# EAGLE design randomcontroller (EAGLE 6.1)
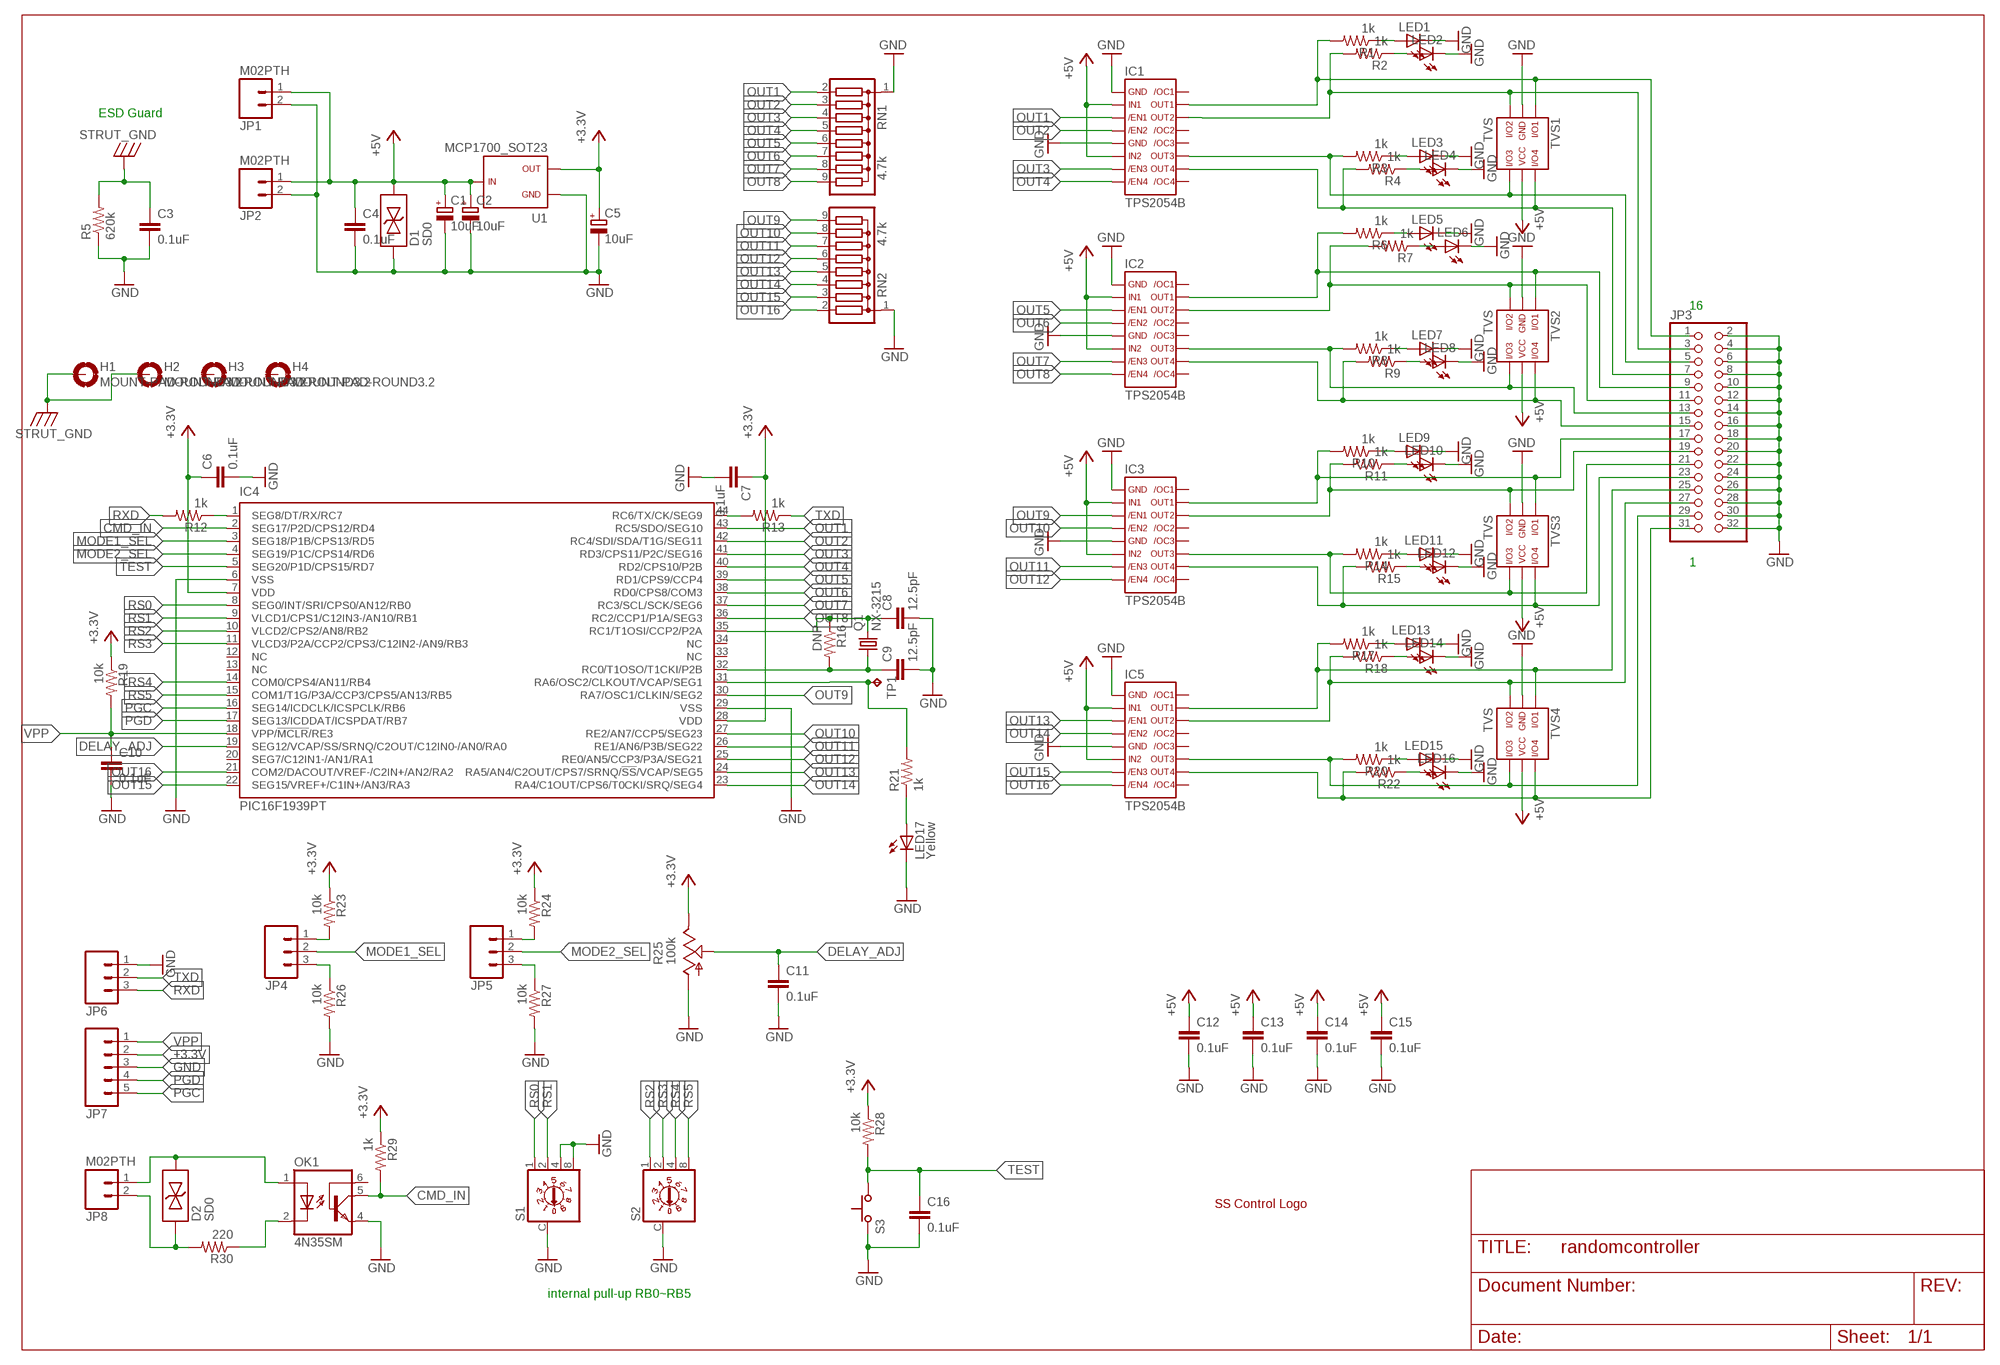
[diagram p0: schematic, sheet 1]

## Parts
C1  10uF  C-TANTAL-A  [C1206(3216)-A]
C2  10uF  C-TANTAL-A  [C1206(3216)-A]
C3  0.1uF  C0805(2012)  [C0805(2012)]
C4  0.1uF  C0805(2012)  [C0805(2012)]
C5  10uF  C-TANTAL-A  [C1206(3216)-A]
C6  0.1uF  C0805(2012)  [C0805(2012)]
C7  0.1uF  C0805(2012)  [C0805(2012)]
C8  12.5pF  C0805(2012)  [C0805(2012)]
C9  12.5pF  C0805(2012)  [C0805(2012)]
C10  0.1uF  C0805(2012)  [C0805(2012)]
C11  0.1uF  C0805(2012)  [C0805(2012)]
C12  0.1uF  C0805(2012)  [C0805(2012)]
C13  0.1uF  C0805(2012)  [C0805(2012)]
C14  0.1uF  C0805(2012)  [C0805(2012)]
C15  0.1uF  C0805(2012)  [C0805(2012)]
C16  0.1uF  C0805(2012)  [C0805(2012)]
D1  SD0  [SOD-323]
D2  SD0  [SOD-323]
H1  MOUNT-PAD-ROUND3.2  [3,2-PAD]
H2  MOUNT-PAD-ROUND3.2  [3,2-PAD]
H3  MOUNT-PAD-ROUND3.2  [3,2-PAD]
H4  MOUNT-PAD-ROUND3.2  [3,2-PAD]
IC1  TPS2054B  [R-PDSO-G16]
IC2  TPS2054B  [R-PDSO-G16]
IC3  TPS2054B  [R-PDSO-G16]
IC4  PIC16F1939PT  [TQFP44]
IC5  TPS2054B  [R-PDSO-G16]
JP1  M02PTH  [1X02]
JP2  M02PTH  [1X02]
JP3  PINHD-2X16/90  [2X16/90]
JP4  M03PTH  [1X03]
JP5  M03PTH  [1X03]
JP6  M03PTH  [1X03]
JP7  M05PTH  [1X05]
JP8  M02PTH  [1X02]
LED1  LEDCHIPLED_0805  [CHIPLED_0805]
LED2  LEDCHIPLED_0805  [CHIPLED_0805]
LED3  LEDCHIPLED_0805  [CHIPLED_0805]
LED4  LEDCHIPLED_0805  [CHIPLED_0805]
LED5  LEDCHIPLED_0805  [CHIPLED_0805]
LED6  LEDCHIPLED_0805  [CHIPLED_0805]
LED7  LEDCHIPLED_0805  [CHIPLED_0805]
LED8  LEDCHIPLED_0805  [CHIPLED_0805]
LED9  LEDCHIPLED_0805  [CHIPLED_0805]
LED10  LEDCHIPLED_0805  [CHIPLED_0805]
LED11  LEDCHIPLED_0805  [CHIPLED_0805]
LED12  LEDCHIPLED_0805  [CHIPLED_0805]
LED13  LEDCHIPLED_0805  [CHIPLED_0805]
LED14  LEDCHIPLED_0805  [CHIPLED_0805]
LED15  LEDCHIPLED_0805  [CHIPLED_0805]
LED16  LEDCHIPLED_0805  [CHIPLED_0805]
LED17  Yellow  LEDCHIPLED_0805  [CHIPLED_0805]
OK1  4N35SM  [DIL6-SMD]
Q1  NX-3215  [NX-3215]
R1  1k  R0805(2012)  [R0805(2012)]
R2  1k  R0805(2012)  [R0805(2012)]
R3  1k  R0805(2012)  [R0805(2012)]
R4  1k  R0805(2012)  [R0805(2012)]
R5  620k  R0805(2012)  [R0805(2012)]
R6  1k  R0805(2012)  [R0805(2012)]
R7  1k  R0805(2012)  [R0805(2012)]
R8  1k  R0805(2012)  [R0805(2012)]
R9  1k  R0805(2012)  [R0805(2012)]
R10  1k  R0805(2012)  [R0805(2012)]
R11  1k  R0805(2012)  [R0805(2012)]
R12  1k  R0805(2012)  [R0805(2012)]
R13  1k  R0805(2012)  [R0805(2012)]
R14  1k  R0805(2012)  [R0805(2012)]
R15  1k  R0805(2012)  [R0805(2012)]
R16  DNP  R0805(2012)  [R0805(2012)]
R17  1k  R0805(2012)  [R0805(2012)]
R18  1k  R0805(2012)  [R0805(2012)]
R19  10k  R0805(2012)  [R0805(2012)]
R20  1k  R0805(2012)  [R0805(2012)]
R21  1k  R0805(2012)  [R0805(2012)]
R22  1k  R0805(2012)  [R0805(2012)]
R23  10k  R0805(2012)  [R0805(2012)]
R24  10k  R0805(2012)  [R0805(2012)]
R25  100k  TRIM_US-B25P  [B25P]
R26  10k  R0805(2012)  [R0805(2012)]
R27  10k  R0805(2012)  [R0805(2012)]
R28  10k  R0805(2012)  [R0805(2012)]
R29  1k  R0805(2012)  [R0805(2012)]
R30  220  R0805(2012)  [R0805(2012)]
RN1  4.7k  G08R  [SIL9]
RN2  4.7k  G08R  [SIL9]
S1  S20BCD  [S20BCD]
S2  S20BCD  [S20BCD]
S3  SWITCH  [SKHLACA010]
TP1  TP  [TP-13]
TVS1  TVS  [TSOP-6]
TVS2  TVS  [TSOP-6]
TVS3  TVS  [TSOP-6]
TVS4  TVS  [TSOP-6]
U1  MCP1700_SOT23  [SOT23]
U$1  LOGO  [SSCONTROL]

## Nets
+3.3V: C5.1(+) C6.1 C7.1 IC4.7(VDD) IC4.28(VDD) JP7.2 R19.1 R23.1 R24.1 R25.E R28.1 R29.1 U1.2
+5V: C1.1(+) C2.1(+) C4.1 C12.1 C13.1 C14.1 C15.1 D1.2 IC1.2 IC1.6 IC2.2 IC2.6 IC3.2 IC3.6 IC5.2 IC5.6 JP1.1 JP2.1 TVS1.5 TVS2.5 TVS3.5 TVS4.5 U1.3
CLKOUT: IC4.31(RA6/OSC2/CLKOUT/VCAP/SEG1) R21.2 TP1.TP
CMD_IN: IC4.2(SEG17/P2D/CPS12/RD4) OK1.5(COL) R29.2
DELAY_ADJ: C11.1 IC4.19(SEG12/VCAP/SS/SRNQ/C2OUT/C12IN0-/AN0/RA0) R25.S
GND: C1.2(-) C2.2(-) C3.2 C4.2 C5.2(-) C6.2 C7.2 C8.2 C9.2 C10.2 C11.2 C12.2 C13.2 C14.2 C15.2 C16.2 D1.1 IC1.1 IC1.5 IC2.1 IC2.5 IC3.1 IC3.5 IC4.6(VSS) IC4.29(VSS) IC5.1 IC5.5 JP1.2 JP2.2 JP3.2 JP3.4 JP3.6 JP3.8 JP3.10 JP3.12 JP3.14 JP3.16 JP3.18 JP3.20 JP3.22 JP3.24 JP3.26 JP3.28 JP3.30 JP3.32 JP6.1 JP7.3 LED1.C LED2.C LED3.C LED4.C LED5.C LED6.C LED7.C LED8.C LED9.C LED10.C LED11.C LED12.C LED13.C LED14.C LED15.C LED16.C LED17.C OK1.4(EMI) R5.1 R25.A R26.2 R27.2 RN1.1 RN2.1 S1.4 S1.8 S1.C S2.C S3.P$1 TVS1.2 TVS2.2 TVS3.2 TVS4.2 U1.1
MODE1_SEL: IC4.3(SEG18/P1B/CPS13/RD5) JP4.2
MODE2_SEL: IC4.4(SEG19/P1C/CPS14/RD6) JP5.2
N$1: D2.2 JP8.1 OK1.1(A)
N$2: LED1.A R1.1
N$3: OK1.2(C) R30.1
N$4: D2.1 JP8.2 R30.2
N$5: LED2.A R2.1
N$6: C8.1 IC4.35(RC1/T1OSI/CCP2/P2A) Q1.2 R16.1
N$7: C9.1 IC4.32(RC0/T1OSO/T1CKI/P2B) Q1.1 R16.2
N$8: LED3.A R3.1
N$9: LED4.A R4.1
N$10: LED5.A R6.1
N$11: LED6.A R7.1
N$12: IC1.15 JP3.1 R1.2 TVS1.1
N$13: IC1.14 JP3.3 R2.2 TVS1.3
N$14: IC1.11 JP3.5 R3.2 TVS1.4
N$15: IC1.10 JP3.7 R4.2 TVS1.6
N$16: IC2.15 JP3.9 R6.2 TVS2.1
N$17: IC2.14 JP3.11 R7.2 TVS2.3
N$18: IC2.11 JP3.13 R8.2 TVS2.4
N$19: IC2.10 JP3.15 R9.2 TVS2.6
N$20: IC3.14 JP3.19 R11.2 TVS3.3
N$21: IC3.11 JP3.21 R14.2 TVS3.4
N$22: IC3.10 JP3.23 R15.2 TVS3.6
N$23: IC3.15 JP3.17 R10.2 TVS3.1
N$24: IC5.14 JP3.27 R18.2 TVS4.3
N$25: IC5.15 JP3.25 R17.2 TVS4.1
N$26: IC5.11 JP3.29 R20.2 TVS4.4
N$27: IC5.10 JP3.31 R22.2 TVS4.6
N$28: LED9.A R10.1
N$29: LED10.A R11.1
N$30: LED11.A R14.1
N$31: LED12.A R15.1
N$32: LED17.A R21.1
N$48: LED13.A R17.1
N$49: LED14.A R18.1
N$50: LED15.A R20.1
N$51: LED16.A R22.1
N$52: LED7.A R8.1
N$53: LED8.A R9.1
N$54: IC4.1(SEG8/DT/RX/RC7) R12.1
N$55: IC4.44(RC6/TX/CK/SEG9) R13.2
N$56: JP5.1 R24.2
N$57: JP4.1 R23.2
N$58: JP4.3 R26.1
N$59: JP5.3 R27.1
OUT1: IC1.3 IC4.43(RC5/SDO/SEG10) RN1.2
OUT2: IC1.4 IC4.42(RC4/SDI/SDA/T1G/SEG11) RN1.3
OUT3: IC1.7 IC4.41(RD3/CPS11/P2C/SEG16) RN1.4
OUT4: IC1.8 IC4.40(RD2/CPS10/P2B) RN1.5
OUT5: IC2.3 IC4.39(RD1/CPS9/CCP4) RN1.6
OUT6: IC2.4 IC4.38(RD0/CPS8/COM3) RN1.7
OUT7: IC2.7 IC4.37(RC3/SCL/SCK/SEG6) RN1.8
OUT8: IC2.8 IC4.36(RC2/CCP1/P1A/SEG3) RN1.9
OUT9: IC3.3 IC4.30(RA7/OSC1/CLKIN/SEG2) RN2.9
OUT10: IC3.4 IC4.27(RE2/AN7/CCP5/SEG23) RN2.8
OUT11: IC3.7 IC4.26(RE1/AN6/P3B/SEG22) RN2.7
OUT12: IC3.8 IC4.25(RE0/AN5/CCP3/P3A/SEG21) RN2.6
OUT13: IC4.24(RA5/AN4/C2OUT/CPS7/SRNQ/!SS!/VCAP/SEG5) IC5.3 RN2.5
OUT14: IC4.23(RA4/C1OUT/CPS6/T0CKI/SRQ/SEG4) IC5.4 RN2.4
OUT15: IC4.22(SEG15/VREF+/C1IN+/AN3/RA3) IC5.7 RN2.3
OUT16: IC4.21(COM2/DACOUT/VREF-/C2IN+/AN2/RA2) IC5.8 RN2.2
PGC: IC4.16(SEG14/ICDCLK/ICSPCLK/RB6) JP7.5
PGD: IC4.17(SEG13/ICDDAT/ICSPDAT/RB7) JP7.4
RS0: IC4.8(SEG0/INT/SRI/CPS0/AN12/RB0) S1.1
RS1: IC4.9(VLCD1/CPS1/C12IN3-/AN10/RB1) S1.2
RS2: IC4.10(VLCD2/CPS2/AN8/RB2) S2.1
RS3: IC4.11(VLCD3/P2A/CCP2/CPS3/C12IN2-/AN9/RB3) S2.2
RS4: IC4.14(COM0/CPS4/AN11/RB4) S2.4
RS5: IC4.15(COM1/T1G/P3A/CCP3/CPS5/AN13/RB5) S2.8
RXD: JP6.3 R12.2
STRUT_GND: C3.1 H1.B3,2(MOUNT) H2.B3,2(MOUNT) R5.2
TEST: C16.1 IC4.5(SEG20/P1D/CPS15/RD7) R28.2 S3.P$2
TXD: JP6.2 R13.1
VPP: C10.1 IC4.18(VPP/!MCLR!/RE3) JP7.1 R19.2
Unconnected: H3.B3,2(MOUNT) H4.B3,2(MOUNT) IC1.9 IC1.12 IC1.13 IC1.16 IC2.9 IC2.12 IC2.13 IC2.16 IC3.9 IC3.12 IC3.13 IC3.16 IC4.12(NC) IC4.13(NC) IC4.20(SEG7/C12IN1-/AN1/RA1) IC4.33(NC) IC4.34(NC) IC5.9 IC5.12 IC5.13 IC5.16 OK1.6(BAS)

## Notes on the sheet
- ESD Guard
- 16
- 1
- internal pull-up RB0~RB5

## Library data of the parts
C1 C2 C5 = yBrainDigital:C-TANTAL-A: TAJA105M020RNJ Tantal Capacitor Manufacturer: AVX 1206(3126) Ref: www.avx.com/docs/techinfo/tantappl.pdf
C3 C4 C6-C16 = WaterDrop:C
D1 D2 = WaterDrop:SD0
H1-H4 = holes:MOUNT-PAD-ROUND: MOUNTING PAD, round
IC1-IC3 IC5 = WaterDrop:TPS2054B
IC4 = microchip:PIC16F193*: Flash-Based, 8-Bit CMOS Microcontrollers wtih LCD Driver and nanoWatt XLP Technology Auto generated by make-symbol-device-package-bsdl.ulp Rev. 33 Source: http://ww1.microchip.com/downloads/en/DeviceDoc/41364D.pdf; MPN: PIC16F1939-I/PT; OC_FARNELL: 1755834; OC_NEWARK: 08R1959
JP1 JP2 JP8 = SparkFun-Connectors:M02: Standard 2-pin 0.1" header. Use with - straight break away headers ( PRT-00116) - right angle break away headers (PRT-00553) - swiss pins (PRT-00743) - machine pins (PRT-00117) - female headers (PRT-00115) Molex polarized connector foot print use with: PRT-08233 with associated crimp pins and housings. 2.54_SCREWTERM for use with PRT-10571. 3.5mm Screw Terminal footprints for PRT-08084 5mm Screw Terminal footprints for use with PRT-08433
JP3 = pinhead:PINHD-2X16: PIN HEADER
JP4-JP6 = SparkFun-Connectors:M03: Header 3 Standard 3-pin 0.1" header. Use with straight break away headers (SKU : PRT-00116), right angle break away headers (PRT-00553), swiss pins (PRT-00743), machine pins (PRT-00117), and female headers (PRT-00115). Molex polarized connector foot print use with SKU : PRT-08232 with associated crimp pins and housings.
JP7 = SparkFun-Connectors:M05: Header 5 Standard 5-pin 0.1" header. Use with straight break away headers (SKU : PRT-00116), right angle break away headers (PRT-00553), swiss pins (PRT-00743), machine pins (PRT-00117), and female headers (PRT-00115). Molex polarized connector foot print use with SKU : PRT-08230 with associated crimp pins and housings.
LED1-LED17 = adafruit:LED: LED OSRAM: - CHIPLED LG R971, LG N971, LY N971, LG Q971, LY Q971, LO R971, LY R971 LH N974, LH R974 LS Q976, LO Q976, LY Q976 LO Q996 - Hyper CHIPLED LW Q18S LB Q993, LB Q99A, LB R99A - SideLED LS A670, LO A670, LY A670, LG A670, LP A670 LB A673, LV A673, LT A673, LW A673 LH A674 LY A675 LS A676, LA A676, LO A676, LY A676, LW A676 LS A679, LY A679, LG A679 - Hyper Micro SIDELED® LS Y876, LA Y876, LO Y876, LY Y876 LT Y87S - SmartLED LW L88C, LW L88S LB L89C, LB L89S, LG L890 LS L89K, LO L89K, LY L89K LS L896, LA L896, LO L896, LY L896 - TOPLED LS T670, LO T670, LY T670, LG T670, LP T670 LSG T670, LSP T670, LSY T670, LOP T670, LYG T670 LG T671, LOG T671, LSG T671 LB T673, LV T673, LT T673, LW T673 LH T674 LS T676, LA T676, LO T676, LY T676, LB T676, LH T676, LSB T676, LW T676 LB T67C, LV T67C, LT T67C, LS T67K, LO T67K, LY T67K, LW E67C LS E67B, LA E67B, LO E67B, LY E67B, LB E67C, LV E67C, LT E67C LW T67C LS T679, LY T679, LG T679 LS T770, LO T770, LY T770, LG T770, LP T770 LB T773, LV T773, LT T773, LW T773 LH T774 LS E675, LA E675, LY E675, LS T675 LS T776, LA T776, LO T776, LY T776, LB T776 LHGB T686 LT T68C, LB T68C - Hyper Mini TOPLED® LB M676 - Mini TOPLED Santana® LG M470 LS M47K, LO M47K, LY M47K Source: http://www.osram.convergy.de/
OK1 = optocoupler:4N*?M: General Purpose 6-Pin Phototransistor Optocouplers Source: http://www.fairchildsemi.com/ds/4N/4N35-M.pdf; MF: FAIRCHILD SEMICONDUCTOR; MPN: 4N35S-M; OC_FARNELL: 1021179; OC_NEWARK: 67K2285
Q1 = OSSI:NX-3215: NDK 32.768 kHz SMD Crystal P/N: NX3215SA-32.768K-STD-MUA-9 Nominal frequency (kHz): 32.768 Package Size (L×W×H : mm): 3.2×1.5×0.8 Operating Temperature Range(*1) / Storage Temperature Range (°C): -40 to +85 / -40 to +85 Level of drive: 0.1µW (Max. 0.5µW) Frequency Tolerance (25±3°C): ±20×10-6 Load Capacitance: 9.0pF, 12.5pF Equivalent Series Resistance: 70kΩ Max. Ordering Code: NX3215SA-32.768K-STD-MUA-9 (Load Capacitance9.0pF) /NX3215SA-32.768K-STD-MUA-8 (Load Capacitance12.5pF)
R1-R24 R26-R30 = WaterDrop:R
R25 = pot:TRIM_US-: POTENTIOMETER
RN1 RN2 = resistor-sil:G08R: SIL RESISTOR; OC_FARNELL: unknown; OC_NEWARK: unknown
S1 S2 = switch-dil:S20BCD: DIL/CODE SWITCH; OC_FARNELL: unknown; OC_NEWARK: unknown
S3 = WaterDrop:SWITCH
TP1 = OSSI:TP
TVS1-TVS4 = WaterDrop:TVS
U1 = OSSI:MCP1700: MCP1700 LDO from Microchips
U$1 = WaterDrop:LOGO

## Board
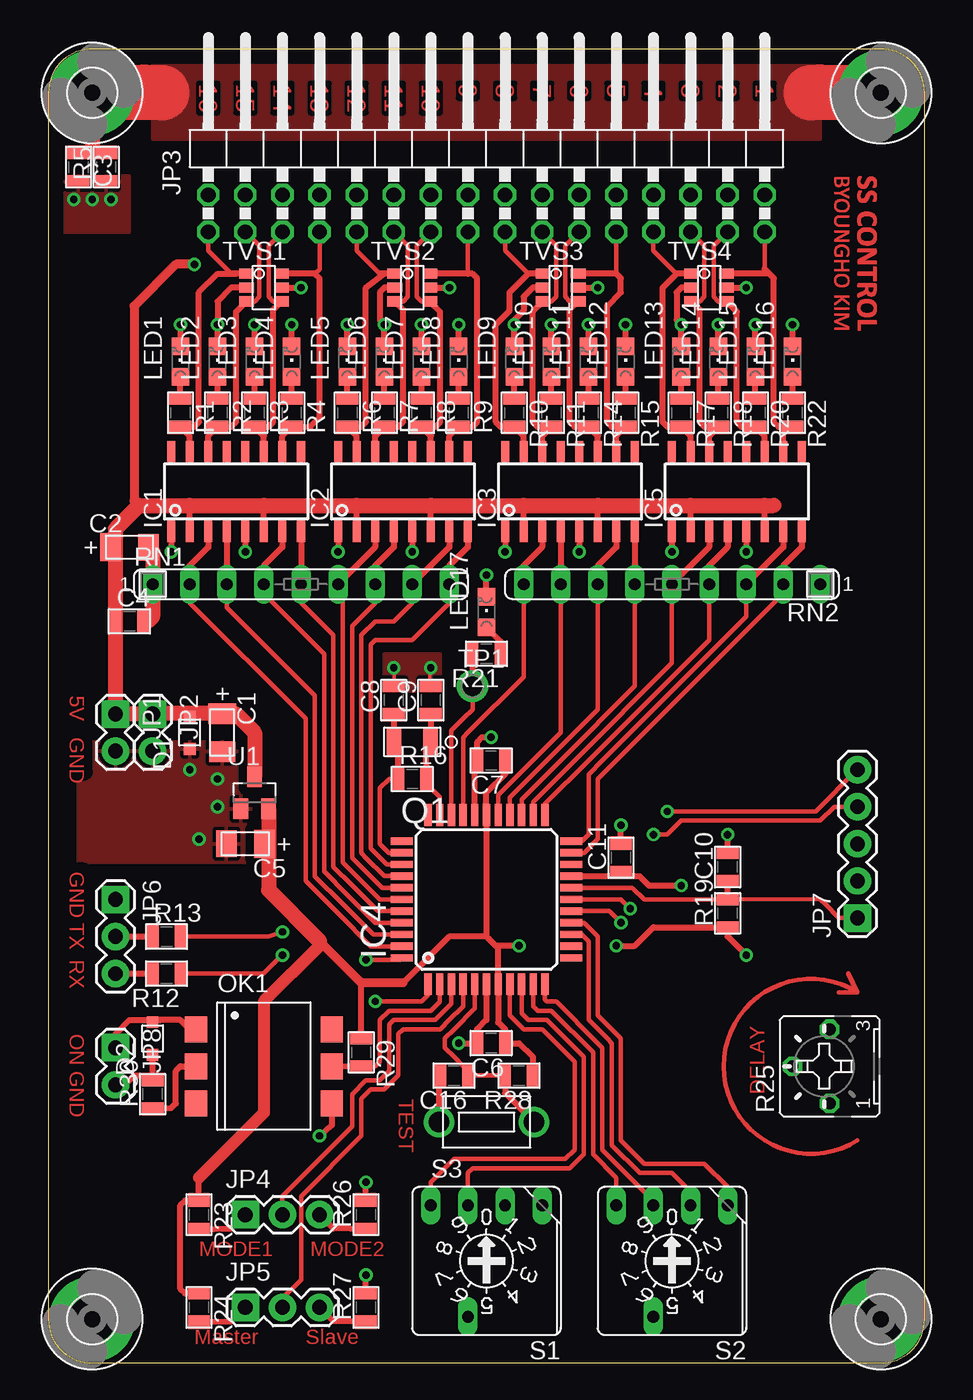
[diagram p1: board, top side]
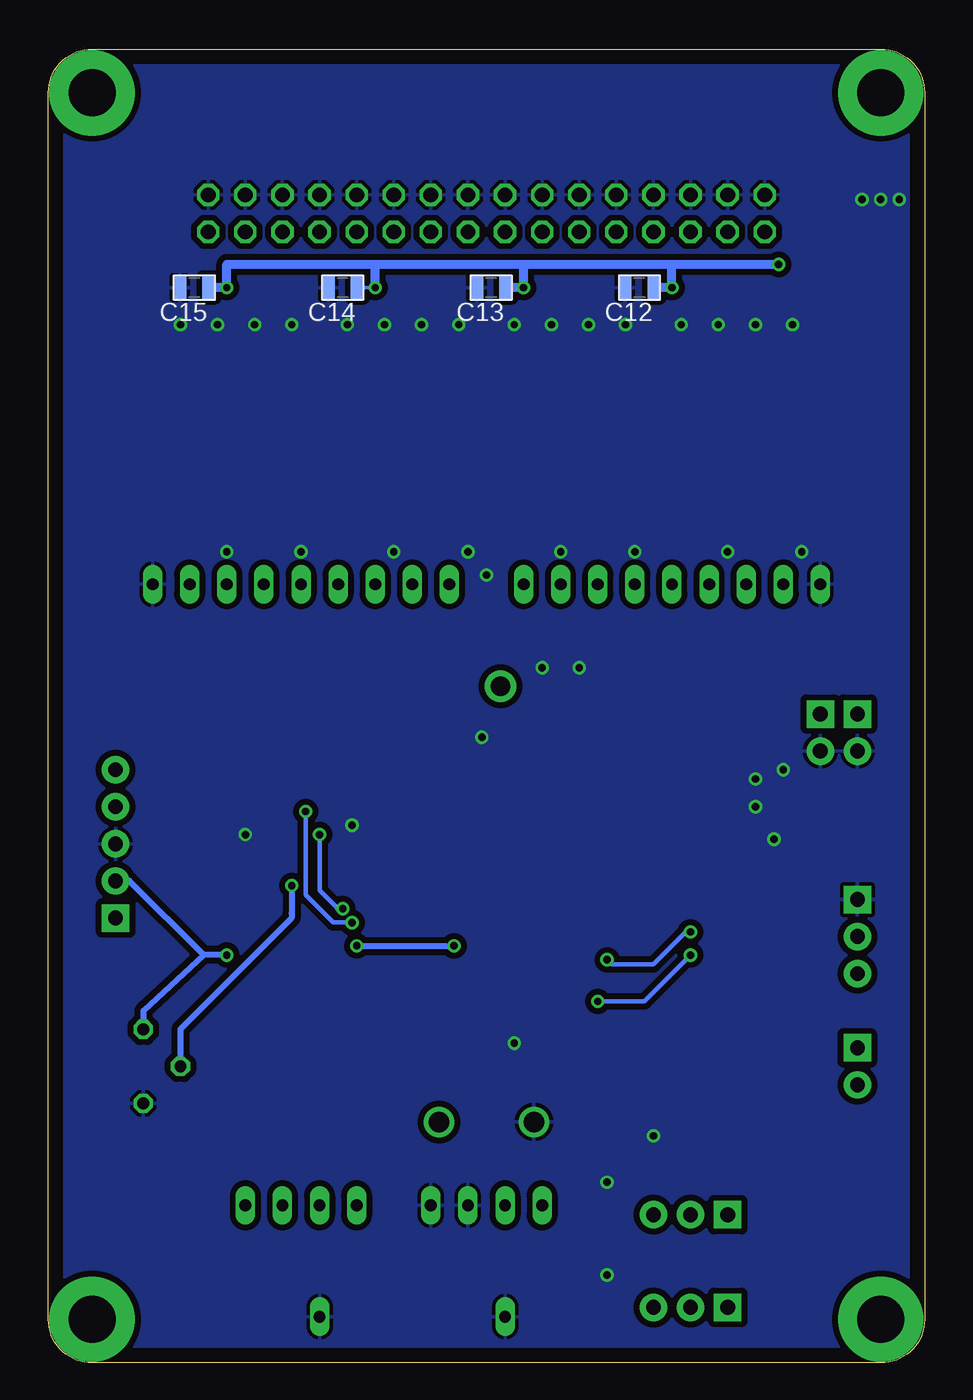
[diagram p2: board, bottom side, seen from below]

Size 60 x 90 mm. Coordinates in mm from the lower left corner, seen from the top.
Outline: 0,87 0,3 arc90 3,0 57,0 arc90 60,3 60,87 arc90 57,90 3,90 arc90 0,87
Copper layers (1*16): Top 0.035mm / dielectric 1.5mm / Bottom 0.035mm
Design rules: minimum track width 10mil, minimum drill 24mil, track to track 8mil, track to pad 8mil, pad to pad 8mil, via to via 8mil, smd to smd 8mil, copper to edge 40mil, drill to drill 8mil, minimum pad ring 10mil, minimum via ring 8mil, stop-mask expansion 4mil, vias tented up to drill 0mil, thermal gap 10mil

### Footprints (pad centres in the part's own frame; a part is rotated, then mirrored left to right if it is on the bottom)
C1206(3216)-A = smd 1.4 x 1.9: 1 -1.3,0 | smd 1.4 x 1.8: 2 1.3,0
C0805(2012) = smd 0.9 x 1.5: 1 -1,0; 2 1,0
SOD-323 = smd 0.8 x 0.8: 1 -1.125,0; 2 1.125,0
3,2-PAD = drill 3.2 pad 5.842: B3,2 0,0
R-PDSO-G16 = smd 0.55 x 1.5: 1 -4.445,-2.7; 2 -3.175,-2.7; 3 -1.905,-2.7; 4 -0.635,-2.7; 5 0.635,-2.7; 6 1.905,-2.7; 7 3.175,-2.7; 8 4.445,-2.7; 9 4.445,2.7; 10 3.175,2.7; 11 1.905,2.7; 12 0.635,2.7; 13 -0.635,2.7; 14 -1.905,2.7; 15 -3.175,2.7; 16 -4.445,2.7
TQFP44 = smd 1.5 x 0.5: 1 -5.8,4; 2 -5.8,3.2; 3 -5.8,2.4; 4 -5.8,1.6; 5 -5.8,0.8; 6 -5.8,0; 7 -5.8,-0.8; 8 -5.8,-1.6; 9 -5.8,-2.4; 10 -5.8,-3.2; 11 -5.8,-4; 23 5.8,-4; 24 5.8,-3.2; 25 5.8,-2.4; 26 5.8,-1.6; 27 5.8,-0.8; 28 5.8,0; 29 5.8,0.8; 30 5.8,1.6; 31 5.8,2.4; 32 5.8,3.2; 33 5.8,4 | smd 0.5 x 1.5: 12 -4,-5.8; 13 -3.2,-5.8; 14 -2.4,-5.8; 15 -1.6,-5.8; 16 -0.8,-5.8; 17 0,-5.8; 18 0.8,-5.8; 19 1.6,-5.8; 20 2.4,-5.8; 21 3.2,-5.8; 22 4,-5.8; 34 4,5.8; 35 3.2,5.8; 36 2.4,5.8; 37 1.6,5.8; 38 0.8,5.8; 39 0,5.8; 40 -0.8,5.8; 41 -1.6,5.8; 42 -2.4,5.8; 43 -3.2,5.8; 44 -4,5.8
1X02 = drill 1.016 pad 1.88 square: 1 0,0 | drill 1.016 pad 1.88: 2 2.54,0
2X16/90 = drill 1.016 octagon: 1 -19.05,-6.35; 2 -19.05,-3.81; 3 -16.51,-6.35; 4 -16.51,-3.81; 5 -13.97,-6.35; 6 -13.97,-3.81; 7 -11.43,-6.35; 8 -11.43,-3.81; 9 -8.89,-6.35; 10 -8.89,-3.81; 11 -6.35,-6.35; 12 -6.35,-3.81; 13 -3.81,-6.35; 14 -3.81,-3.81; 15 -1.27,-6.35; 16 -1.27,-3.81; 17 1.27,-6.35; 18 1.27,-3.81; 19 3.81,-6.35; 20 3.81,-3.81; 21 6.35,-6.35; 22 6.35,-3.81; 23 8.89,-6.35; 24 8.89,-3.81; 25 11.43,-6.35; 26 11.43,-3.81; 27 13.97,-6.35; 28 13.97,-3.81; 29 16.51,-6.35; 30 16.51,-3.81; 31 19.05,-6.35; 32 19.05,-3.81
1X03 = drill 1.016 pad 1.88 square: 1 0,0 | drill 1.016 pad 1.88: 2 2.54,0; 3 5.08,0
1X05 = drill 1.016 pad 1.88 square: 1 0,0 | drill 1.016 pad 1.88: 2 2.54,0; 3 5.08,0; 4 7.62,0; 5 10.16,0
CHIPLED_0805 = smd 1.2 x 1.2: A 0,-1.05; C 0,1.05
DIL6-SMD = smd 1.78 x 1.52: 1 -2.54,-4.645; 2 0,-4.645; 3 2.54,-4.645; 4 2.54,4.645; 5 0,4.645; 6 -2.54,4.645
NX-3215 = smd 1 x 1.8: 1 -1.25,0; 2 1.25,0
R0805(2012) = smd 0.9 x 1.5: 1 -1,0; 2 1,0
B25P = drill 0.813 octagon: A -2.54,0; E 2.54,0; S 0,2.54
SIL9 = drill 0.813 long: 1 -10.16,0; 2 -7.62,0; 3 -5.08,0; 4 -2.54,0; 5 0,0; 6 2.54,0; 7 5.08,0; 8 7.62,0; 9 10.16,0
S20BCD = drill 0.813 long: 1 3.81,-3.81; 2 1.27,-3.81; 4 -1.27,-3.81; 8 -3.81,-3.81; C 1.27,3.81
SKHLACA010 = drill 1.4: P$1 -3.25,0; P$2 3.25,0
TP-13 = drill 1.321 pad 2.159: TP 0,0
TSOP-6 = smd 0.7 x 1: 1 -0.95,-1.2; 2 0,-1.2; 3 0.95,-1.2; 4 0.95,1.2; 5 0,1.2; 6 -0.95,1.2
SOT23 = smd 1 x 1.4: 1 -0.95,-1.1; 2 0.95,-1.1; 3 0,1.1

### Placement (x,y rotation side)
C1  11.9,43.18 270 top
C2  5.55,55.88 0 top
C3  2.06,81.92 270 top
C4  5.55,50.8 0 top
C5  13.49,35.56 180 top
C6  30.32,21.91 180 top
C7  30.32,41.27 180 top
C8  23.65,45.4 90 top
C9  26.19,45.4 90 top
C10  46.51,33.97 90 top
C11  39.21,34.61 90 top
C12  19.52,73.66 180 bottom
C13  29.68,73.66 180 bottom
C14  39.84,73.66 180 bottom
C15  50,73.66 180 bottom
C16  27.78,19.68 180 top
D1  9.68,43.18 90 top
D2  7.14,22.23 90 top
H1  3,87 0 top
H2  57,87 0 top
H3  3,3 0 top
H4  57,3 0 top
IC1  12.86,59.69 0 top
IC2  24.29,59.69 0 top
IC3  35.72,59.69 0 top
IC4  30,31.75 90 top
IC5  47.14,59.69 0 top
JP1  4.6,44.45 270 top
JP2  7.14,44.45 270 top
JP3  30,83.82 0 top
JP4  13.49,10.16 0 top
JP5  13.49,3.81 0 top
JP6  4.6,31.75 270 top
JP7  55.4,30.48 90 top
JP8  4.6,21.59 270 top
LED1  9.05,68.58 0 top
LED2  11.59,68.58 0 top
LED3  14.12,68.58 0 top
LED4  16.66,68.58 0 top
LED5  20.48,68.58 0 top
LED6  23.02,68.58 0 top
LED7  25.55,68.58 0 top
LED8  28.09,68.58 0 top
LED9  31.91,68.58 0 top
LED10  34.45,68.58 0 top
LED11  36.98,68.58 0 top
LED12  39.52,68.58 0 top
LED13  43.34,68.58 0 top
LED14  45.88,68.58 0 top
LED15  48.41,68.58 0 top
LED16  50.95,68.58 0 top
LED17  30,51.44 0 top
OK1  14.76,20.32 270 top
Q1  24.92,42.55 180 top
R1  9.05,65.09 270 top
R2  11.59,65.09 270 top
R3  14.12,65.09 270 top
R4  16.66,65.09 270 top
R5  3.96,81.92 90 top
R6  20.48,65.09 270 top
R7  23.02,65.09 270 top
R8  25.55,65.09 270 top
R9  28.09,65.09 270 top
R10  31.91,65.09 270 top
R11  34.45,65.09 270 top
R12  8.09,26.67 180 top
R13  8.09,29.21 0 top
R14  36.98,65.09 270 top
R15  39.52,65.09 270 top
R16  24.92,40.01 0 top
R17  43.34,65.09 270 top
R18  45.88,65.09 270 top
R19  46.51,30.8 90 top
R20  48.41,65.09 270 top
R21  30,48.58 180 top
R22  50.95,65.09 270 top
R23  10.32,10.16 270 top
R24  10.32,3.81 270 top
R25  53.5,20.32 90 top
R26  21.74,10.16 90 top
R27  21.74,3.81 90 top
R28  32.22,19.68 180 top
R29  21.43,21.27 270 top
R30  7.14,18.41 90 top
RN1  17.3,53.34 0 top
RN2  42.7,53.34 180 top
S1  30,6.99 180 top
S2  42.7,6.99 180 top
S3  30,16.51 0 top
TP1  29.05,46.35 0 top
TVS1  14.76,73.66 270 top
TVS2  24.92,73.66 270 top
TVS3  35.08,73.66 270 top
TVS4  45.24,73.66 270 top
U1  14.12,39.05 0 top
U$1  53.81,81.28 270 top

### Tracks (layer width: path | path; a pad name or v marks a point on that pad's centre or on a via)
+3.3V  (via drill 0.5)
  Top 0.406: C7.1 31.27,40.64 31.27,40.32 30,39.05 IC4.28 30,29.21 | R24.1 9.36,4.76 9.05,5.08 9.05,10.79 9.36,11.11 10.31,11.11 R23.1 10.32,12.7 | R29.1 21.43,26.04 | R28.1 33.17,19.69 33.17,20.95 32.22,21.91 C6.1 31.32,22.81 30.8,23.33 IC4.7 30.8,28.41 30.16,29.05 | 30,29.21 27.46,29.21 24.29,26.04 | 30.16,29.05 30,29.21 | R19.1 46.51,29.84 | 46.51,29.84 46.51,29.21 v47.78,27.94 | v32.22,28.57 30.64,28.57 30.16,29.05 | v38.89,28.57 40.16,28.57 41.43,29.84 46.51,29.84
  Top 0.61: 18.41,29.05 21.43,26.04 24.29,26.04
  Top 0.813: 18.57,28.89 18.57,28.57 14.76,24.77 14.76,17.14 10.32,12.7
  Top 1.016: C5.1 15.07,35.84 U1.2 15.07,32.39 18.41,29.05 18.57,28.89
  Bottom 0.406: v38.89,28.57 v32.22,28.57 | v47.78,27.94 49.37,27.94 | 49.37,27.94 53.5,24.13 R25.E | JP7.2 54.45,33.02 49.37,27.94
+5V  (via drill 0.5)
  Top 0.254: D1.2 9.68,44.48
  Top 0.406: IC1.2 9.68,58.74 | IC1.6 14.76,58.74 | IC2.2 21.11,58.74 | IC2.6 26.19,58.74 | IC3.2 32.54,58.74 | IC3.6 37.62,58.74 | IC5.2 43.97,58.74 | IC5.6 49.05,58.74 | C4.1 4.6,50.8 | C2.1 4.57,57.12 4.6,57.15 | TVS1.5 v17.3,73.66 | TVS2.5 v27.46,73.66 | TVS3.5 v37.62,73.66 | TVS4.5 v47.78,73.66
  Top 0.61: v10,75.25 8.73,75.25 5.87,72.39 5.87,59.05 6.19,58.74
  Top 1.016: 49.69,58.74 49.05,58.74 43.97,58.74 37.62,58.74 32.54,58.74 26.19,58.74 21.11,58.74 14.76,58.74 9.68,58.74 6.19,58.74 4.6,57.15 4.6,50.8 JP1.1 JP2.1 7.17,44.48 9.68,44.48 C1.1 12.82,44.48 14.12,43.18 U1.3
  Bottom 0.254: C14.1 38.7,73.66 37.8,73.66 v37.62,73.66
  Bottom 0.61: 17.3,75.25 v17.3,73.66 C12.1 | 17.3,75.25 v10,75.25 | 27.46,75.25 v27.46,73.66 C13.1 | 27.46,75.25 17.3,75.25 | v37.62,73.66 37.62,75.25 | 37.62,75.25 27.46,75.25 | 37.62,75.25 47.78,75.25 v47.78,73.66 C15.1
CLKOUT
  Top 0.305: IC4.31 27.6,43.32 28.41,44.13 29.05,44.77 TP1.TP
  Top 0.406: TP1.TP 29.05,48.58 R21.2
CMD_IN
  Top 0.305: IC4.2 26.8,24.74 26.19,24.13 23.33,24.13 22.7,23.5 22.7,20.64 22.38,20.32 R29.2
  Top 0.406: R29.2 OK1.5
DELAY_ADJ  (via drill 0.5)
  Top 0.406: IC4.19 38.88,33.35 | 38.88,33.35 C11.1 | 38.88,33.35 40.47,33.35 41.11,32.7 v43.34,32.7
  Bottom 0.406: v43.34,32.7 43.34,30.8 43.34,30.48 46.83,26.99 50.95,22.86 R25.S
GND  (via drill 0.5)
  Top 0.254: C8.2 23.7,46.43 23.7,47.33 v23.65,47.62 | C9.2 26.1,46.43 26.1,47.33 v26.19,47.62
  Top 0.406: v9.05,71.12 LED1.C | LED1.C 9.05,69.53 LED1.C | LED2.C v11.59,71.12 11.59,72.71 12.54,73.66 TVS1.2 | LED3.C v14.12,71.12 | LED4.C v16.66,71.12 | LED5.C v20.48,71.12 | LED6.C v23.02,71.12 22.7,71.44 22.7,73.34 23.02,73.66 TVS2.2 | LED7.C v25.55,71.12 | LED8.C v28.09,71.12 | LED9.C v31.91,71.12 31.91,71.44 32.22,71.75 32.54,72.07 32.54,73.03 33.17,73.66 TVS3.2 | LED10.C v34.45,71.12 | LED11.C v36.98,71.12 | LED12.C v39.52,71.12 | LED13.C v43.34,71.12 43.02,71.44 43.02,73.34 43.34,73.66 TVS4.2 | LED14.C v45.88,71.12 | LED15.C v48.41,71.12 | LED16.C v50.95,71.12 | IC1.1 v8.41,55.56 | IC1.5 v13.49,55.56 | IC2.1 v19.84,55.56 | IC2.5 v24.92,55.56 | IC3.1 v31.27,55.56 | IC3.5 v36.35,55.56 | IC5.1 v42.7,55.56 | IC5.5 v47.78,55.56 | IC4.29 29.2,40.81 C7.2 29.37,42.55 29.68,42.86 v30.32,42.86 | C11.2 v39.21,36.83 | C10.2 v46.51,36.2 | 6.82,50.8 C4.2 | S3.P$1 26.75,19.61 C16.2 | R26.2 v21.74,12.38 | R27.2 v21.74,6.03 | OK1.4 19.41,16.31 v18.57,15.56 | IC4.6 30,23.5 29.36,22.86 29.37,22.55 C6.2 v28.09,21.91 | LED17.C v30,53.98
  Top 1.016: C2.2 7.17,55.56 7.17,53.37 RN1.1 7.14,51.12 6.82,50.8
  other vias: 10.32,35.88 11.59,38.1 11.59,40.01 9.68,40.64 1.74,79.69 4.28,79.69 3.01,79.69
  pour Bottom (isolate 0.406): -0.48,90.17 60.48,90.17 60.48,0 -0.48,0
  pour Top (isolate 0.61): 2.06,42.55 14.12,42.55 14.12,36.83 13.81,36.83 13.81,34.29 2.06,34.29
  pour Top: 0.79,81.28 5.55,81.28 5.55,77.47 0.79,77.47
  pour Top: 23.02,48.26 23.02,46.04 26.82,46.04 26.82,48.58 23.02,48.58
MODE1_SEL
  Top 0.305: IC4.3 27.6,24.59 26.51,23.5 23.65,23.5 23.33,23.18 23.33,20 22.7,19.37 21.74,19.37 20.79,18.41 20.79,16.19 16.03,11.43 JP4.2
MODE2_SEL
  Top 0.305: IC4.4 28.4,24.43 27.46,23.5 26.82,22.86 24.29,22.86 23.97,22.54 23.97,19.68 23.02,18.73 22.06,18.73 21.43,18.1 21.43,15.88 | JP5.2 16.03,4.45 17.3,5.71 17.3,11.43 21.43,15.56 | 21.43,15.56 21.43,15.88 | 21.43,15.88 21.43,15.56 | 21.43,15.56 21.43,15.88
N$1
  Top 0.406: JP8.1 4.6,22.54 5.55,23.5 7.29,23.5 | 7.29,23.5 7.63,23.5 D2.2 7.29,23.5 | OK1.1 9.68,22.86 9.05,23.5 7.29,23.5
N$2
  Top 0.406: R1.1 LED1.A
N$3
  Top 0.406: R30.1 8.41,17.46 8.73,17.78 8.73,20 9.05,20.32 OK1.2
N$4
  Top 0.406: JP8.2 5.23,19.05 5.87,19.68 7.14,19.68 | 7.14,19.68 R30.2 7.14,19.68 | 7.14,19.68 D2.1
N$5
  Top 0.406: R2.1 LED2.A
N$6
  Top 0.305: R16.1 23.33,40.01 22.7,39.37 22.7,35.56 23.02,35.24 23.31,34.95 IC4.35
  Top 0.406: R16.1 23.97,41.59 23.65,41.91 23.65,42.52 Q1.2 23.65,42.56 C8.1
N$7
  Top 0.305: IC4.32 26.8,38.76 26.19,39.37 25.87,39.69
  Top 0.406: 25.87,39.69 R16.2 25.87,42.24 Q1.1 26.19,42.56 C9.1
N$8
  Top 0.406: R3.1 LED3.A
N$9
  Top 0.406: R4.1 LED4.A
N$10
  Top 0.406: R6.1 LED5.A
N$11
  Top 0.406: R7.1 LED6.A
N$12
  Top 0.305: 12.54,74.61 10.95,76.2 JP3.1
  Top 0.406: TVS1.1 12.86,74.61 | 12.86,74.61 12.54,74.61 | 12.86,74.61 11.59,74.61 10.32,73.34 10.32,64.45 10,64.14 R1.2 9.68,63.5 IC1.15
N$13
  Top 0.305: TVS1.3 14.13,72.71 14.44,73.03 14.44,76.52 JP3.3
  Top 0.406: TVS1.3 12.86,72 12.86,64.45 12.54,64.14 R2.2 10.95,63.5 IC1.14
N$14
  Top 0.305: TVS1.4 15.39,72.71 15.08,73.03 15.08,76.52 JP3.5
  Top 0.406: TVS1.4 15.39,72.14 15.39,64.45 15.08,64.14 R3.2 14.76,63.5 IC1.11
N$15
  Top 0.305: JP3.7 18.57,74.93 18.25,74.61
  Top 0.406: IC1.10 16.03,63.5 R4.2 17.94,64.14 18.57,64.77 18.57,74.3 18.25,74.61 16.03,74.61 TVS1.6
N$16
  Top 0.305: JP3.9 21.11,76.2 22.38,74.93 22.7,74.61
  Top 0.406: TVS2.1 23.02,74.61 | 23.02,74.61 22.7,74.61 | 23.02,74.61 21.74,73.66 21.74,64.45 21.43,64.14 R6.2 21.11,63.5 IC2.15
N$17
  Top 0.305: TVS2.3 24.29,72.71 24.6,73.03 24.6,76.52 JP3.11
  Top 0.406: TVS2.3 24.29,72.14 24.29,64.45 23.97,64.14 R7.2 22.38,63.5 IC2.14
N$18
  Top 0.305: TVS2.4 25.55,72.71 25.24,73.03 25.24,76.52 JP3.13
  Top 0.406: TVS2.4 26.82,72 26.82,64.45 26.51,64.14 R8.2 26.19,63.5 IC2.11
N$19
  Top 0.305: JP3.15 28.73,74.61
  Top 0.406: IC2.10 27.46,63.5 R9.2 29.05,64.14 29.36,64.45 29.36,74.3 29.05,74.61 28.73,74.61 TVS2.6
N$20
  Top 0.305: TVS3.3 34.45,72.71 34.76,73.03 34.76,76.52 JP3.19
  Top 0.406: TVS3.3 33.17,72 33.17,64.45 33.49,64.14 R11.2 33.81,63.5 IC3.14
N$21
  Top 0.305: TVS3.4 35.71,72.71 35.4,73.03 35.4,76.52 JP3.21
  Top 0.406: TVS3.4 35.72,72.14 35.72,64.45 36.03,64.14 R14.2 37.62,63.5 IC3.11
N$22
  Top 0.305: JP3.23 38.89,74.61
  Top 0.406: IC3.10 38.89,63.5 R15.2 38.57,64.14 38.26,64.45 38.26,72.39 39.21,73.34 39.21,74.3 38.89,74.61 36.35,74.61 TVS3.6
N$23
  Top 0.305: JP3.17 31.27,76.2 32.54,74.93 32.86,74.61
  Top 0.406: TVS3.1 32.86,74.61 31.59,73.34 31.59,72.07 30.64,71.11 30.64,64.45 30.95,64.14 R10.2 32.54,63.5 IC3.15
N$24
  Top 0.305: TVS4.3 44.61,72.71 44.92,73.03 44.92,76.52 JP3.27
  Top 0.406: TVS4.3 44.61,72.14 44.61,64.45 44.92,64.14 R18.2 45.24,63.5 IC5.14
N$25
  Top 0.305: JP3.25 41.43,76.2 42.7,74.93 43.02,74.61
  Top 0.406: TVS4.1 43.02,74.61 42.06,73.66 42.06,64.45 42.38,64.14 R17.2 43.97,63.5 IC5.15
N$26
  Top 0.305: TVS4.4 45.87,72.71 45.56,73.03 45.56,76.52 JP3.29
  Top 0.406: TVS4.4 47.14,72 47.14,64.45 47.46,64.14 R20.2 49.05,63.5 IC5.11
N$27
  Top 0.305: JP3.31 49.05,74.93
  Top 0.406: 49.37,74.61 49.69,74.3 49.69,64.45 50,64.14 R22.2 50.95,64.14 50.64,64.14 50.32,63.82 IC5.10 | 49.37,74.61 TVS4.6 | 49.05,74.93 49.37,74.61
N$28
  Top 0.406: R10.1 LED9.A
N$29
  Top 0.406: R11.1 LED10.A
N$30
  Top 0.406: R14.1 LED11.A
N$31
  Top 0.406: R15.1 LED12.A
N$32
  Top 0.406: R21.1 30.95,49.44 LED17.A
N$33
  Top 0.305: 55.4,25.4 arc244 55.4,15.24 | 55.4,25.4 54.77,26.67 | 55.4,25.4 54.13,25.4
N$48
  Top 0.406: R17.1 LED13.A
N$49
  Top 0.406: R18.1 LED14.A
N$50
  Top 0.406: R20.1 LED15.A
N$51
  Top 0.406: R22.1 LED16.A
N$52
  Top 0.406: R8.1 LED7.A
N$53
  Top 0.406: R9.1 LED8.A
N$54  (via drill 0.5)
  Top 0.305: R12.1 14.76,26.67 v16.03,27.94 | v22.38,24.77 25.55,24.77 26,25.21 IC4.1
  Bottom 0.305: v16.03,27.94 19.2,24.77 v22.38,24.77
N$55  (via drill 0.5)
  Top 0.305: R13.2 15.08,29.21 v16.03,29.53 | v21.74,27.62 24.07,27.62 IC4.44
  Bottom 0.305: v16.03,29.53 16.35,29.53 18.57,27.3 21.43,27.3 v21.74,27.62
N$56
  Top 0.406: R24.2 12.54,2.86 JP5.1
N$57
  Top 0.406: R23.2 12.54,9.21 JP4.1
N$58
  Top 0.406: R26.1 19.52,9.21 JP4.3
N$59
  Top 0.406: R27.1 19.52,2.86 JP5.3
OUT1
  Top 0.305: IC4.43 22.09,28.55 19.84,30.8 17.62,33.02 17.62,44.13 17.3,44.45 9.68,52.07 RN1.2
  Top 0.406: IC1.3 10.95,55.88 9.68,54.61 RN1.2
OUT2
  Top 0.305: IC4.42 22.24,29.35 20.16,31.43 18.25,33.34 18.25,45.72 12.22,51.75 RN1.3
  Top 0.406: IC1.4 RN1.3
OUT3
  Top 0.305: IC4.41 22.39,30.15 20.48,32.07 18.89,33.66 18.89,48.58 14.76,52.7 | RN1.4 14.76,52.7 | 14.76,52.7 RN1.4 | RN1.4 14.76,52.7
  Top 0.406: IC1.7 16.03,55.88 14.76,54.61 RN1.4
OUT4
  Top 0.305: IC4.40 22.55,30.95 20.79,32.7 19.52,33.97 19.52,46.35 19.52,49.85 17.3,52.07 RN1.5
  Top 0.406: IC1.8 RN1.5
OUT5
  Top 0.305: IC4.39 22.7,31.75 21.11,33.34 20.16,34.29 20.16,53.02 RN1.6
  Top 0.406: IC2.3 22.38,55.88 21.11,54.61 RN1.6 20.16,53.02
OUT6
  Top 0.305: IC4.38 22.85,32.55 21.43,33.97 20.79,34.61 20.79,49.85 20.79,50.48 22.38,52.07 RN1.7
  Top 0.406: IC2.4 23.65,55.88 22.38,54.61 RN1.7
OUT7
  Top 0.305: IC4.37 23,33.35 21.74,34.61 21.43,34.92 21.43,49.53 21.43,49.85 22.38,50.8 23.65,50.8 24.92,52.07 RN1.8
  Top 0.406: IC2.7 27.46,55.88 26.19,54.61 RN1.8
OUT8
  Top 0.305: IC4.36 23.16,34.15 22.06,35.24 22.06,49.21 22.38,49.53 24.92,49.53 27.46,52.07 RN1.9
  Top 0.406: IC2.8 28.73,55.88 27.46,54.61 RN1.9
OUT9
  Top 0.305: IC4.30 28.4,42.85 28.73,43.18 32.54,46.99 RN2.9
  Top 0.406: IC3.3 33.81,55.88 32.54,54.61 RN2.9
OUT10
  Top 0.305: IC4.27 30.8,38.9 32.86,40.96 33.17,41.27 35.08,43.18 RN2.8
  Top 0.406: IC3.4 RN2.8
OUT11
  Top 0.305: IC4.26 31.6,38.75 34.13,41.27 37.62,44.77 RN2.7
  Top 0.406: IC3.7 38.89,55.88 37.62,54.61 RN2.7
OUT12
  Top 0.305: IC4.25 32.4,38.59 35.08,41.27 40.16,46.35 40.16,52.07 RN2.6
  Top 0.406: IC3.8 RN2.6
OUT13
  Top 0.305: IC4.24 33.2,38.44 36.03,41.27 42.7,47.94 RN2.5
  Top 0.406: IC5.3 45.24,55.88 43.97,54.61 RN2.5
OUT14
  Top 0.305: IC4.23 34,38.29 36.98,41.27 45.24,49.53 RN2.4
  Top 0.406: IC5.4 46.51,55.88 45.24,54.61 RN2.4
OUT15
  Top 0.305: IC4.22 36.54,35.75 36.98,36.2 36.98,40.32 37.94,41.27 47.78,51.12 RN2.3
  Top 0.406: IC5.7 50.32,55.88 49.05,54.61 RN2.3
OUT16
  Top 0.305: IC4.21 36.69,34.95 37.62,35.88 37.62,40.01 38.89,41.27 50.32,52.7 RN2.2
  Top 0.406: IC5.8 51.59,55.88 50.32,54.61 RN2.2 50.32,53.02
PGC  (via drill 0.5)
  Top 0.305: IC4.16 38.42,30.95 v39.21,30.16 | v42.38,37.78 52.54,37.78 JP7.5
  Bottom 0.305: v39.21,30.16 40.48,30.16 41.11,30.8 42.38,32.07 v42.38,37.78
PGD  (via drill 0.5)
  Top 0.305: IC4.17 39.21,31.75 v39.84,31.11 | v41.43,36.2 42.38,36.2 43.34,37.15 52.86,37.15 53.81,38.1 JP7.4
  Bottom 0.305: 40.16,31.11 41.43,32.38 41.43,35.56 v41.43,36.2
  Bottom 0.406: v39.84,31.11 40.16,31.11
RS0
  Top 0.305: S1.1 26.19,12.38 27.78,13.97 35.4,13.97 36.03,14.61 36.03,20.64 35.72,20.95 33.81,22.86 32.54,22.86 31.6,23.8 IC4.8
RS1
  Top 0.305: S1.2 28.73,13.02 29.05,13.34 35.72,13.34 36.35,13.97 36.67,14.29 36.67,20.95 34.13,23.5 32.86,23.5 32.4,23.95 IC4.9
RS2
  Top 0.305: IC4.10 33.2,24.42 33.49,24.13 34.45,24.13 37.3,21.27 37.3,14.29 38.89,12.7 S2.1
RS3
  Top 0.305: IC4.11 34,24.89 34.13,24.77 34.76,24.77 37.62,21.91 37.94,21.59 37.94,14.61 41.43,11.11 S2.2
RS4
  Top 0.305: IC4.14 36.53,29.35 36.98,28.89 36.98,23.5 38.26,22.23 38.57,21.91 38.57,14.92 40.48,13.02 42.7,13.02 43.34,12.38 43.97,11.75 S2.4
RS5
  Top 0.305: IC4.15 36.68,30.15 37.62,29.21 37.62,23.81 38.57,22.86 39.21,22.23 39.21,15.24 40.8,13.65 44.92,13.65 46.51,12.06 S2.8
RXD
  Top 0.406: JP6.3 7.14,26.67 R12.2
STRUT_GND
  Top 0.813: R5.2 3.01,82.86 C3.1
  Top 1.016: 7.77,87 3.01,85.72 3.01,85.41 3.01,82.86
  Top 3.81: H1.B3,2 6.56,87.05 7.77,87 | H2.B3,2 52.81,87.05 52.23,87
  pour Top: 7.14,90.17 52.86,90.17 52.86,83.82 7.14,83.82
TEST
  Top 0.305: R28.2 C16.1 28.73,20.32 28.41,20.32 27.78,20.95 27.14,21.59 27.14,22.23 27.78,22.86 29.2,24.28 IC4.5
  Top 0.406: R28.2 31.27,18.49 S3.P$2
TXD
  Top 0.406: JP6.2 R13.1
VPP
  Top 0.305: JP7.1 54.13,30.48 53.18,31.43 52.86,31.75 R19.2 | IC4.18 39.99,32.55 40.8,31.75 46.51,31.75
  Top 0.406: C10.1 R19.2 46.51,31.75

### Text on the board
Top: 16 | 15 | 14 | 13 | 12 | 11 | 10 | 9 | 8 | 7 | 6 | 5 | 4 | 3 | 2 | 1 | 5V | GND | GND | TX | RX | ON | GND | TEST | DELAY | MODE1 | MODE2 | Master | Slave
tStop: 16 | 15 | 14 | 13 | 12 | 11 | 10 | 9 | 8 | 7 | 6 | 5 | 4 | 3 | 2 | 1 | 5V | GND | GND | TX | RX | ON | GND | TEST | DELAY | MODE1 | MODE2 | Master | Slave